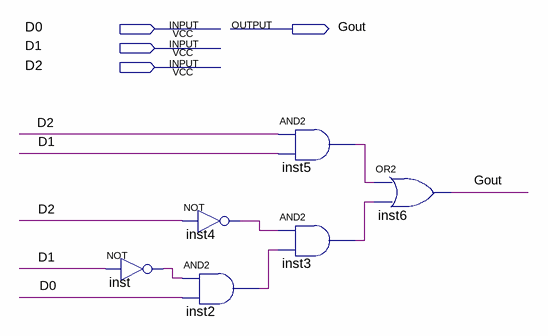
[diagram p0: schematic sheet]
// Quartus schematic G-Logic.bdf as structural Verilog: 6 symbols, 4 pins
module \G-Logic  (
  input  D0,
  input  D1,
  input  D2,
  output Gout
);

  wire inst2_out, inst3_out, inst4_out, inst5_out, inst_out;

  not inst (inst_out, D1);
  not inst4 (inst4_out, D2);
  and inst2 (inst2_out, inst_out, D0);
  and inst5 (inst5_out, D2, D1);
  and inst3 (inst3_out, inst4_out, inst2_out);
  or inst6 (Gout, inst5_out, inst3_out);
endmodule
